# Altium schematic sheet Ampli3.SchDoc
size A4
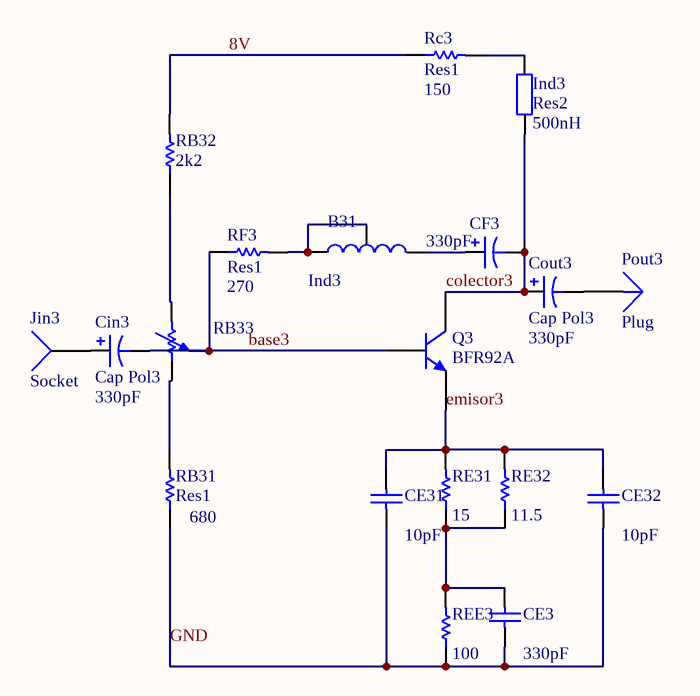
[diagram p0: Ampli3.SchDoc]

## Parts
B31  Ind3  [Ind 7mm]
CE3  value 330pF  [1608[0603]]  (hidden comment: Cap Semi)
CE31  value 10pF  [1608[0603]]  (hidden comment: Cap Semi)
CE32  value 10pF  [1608[0603]]  (hidden comment: Cap Semi)
CF3  value 330pF  [C0805]  (hidden comment: Cap Pol3)
Cin3  Cap Pol3  value 330pF  [C0805]
Cout3  Cap Pol3  value 330pF  [C0805]
Ind3  Res2  value 500nH  [AXIAL-0.4]
Jin3  Socket  [PIN1]
Pout3  Plug  [PIN1]
Q3  BFR92A  [SOT23]
RB31  Res1  value 680  [AXIAL-0.3]
RB32  value 2k2  [AXIAL-0.3]  (hidden comment: Res1)
RB33  Pot  [Potenciometro]  (value not drawn)
Rc3  Res1  value 150  [AXIAL-0.3]
RE31  value 15  [1608[0603]]  (hidden comment: Res Semi)
RE32  value 11.5  [2012[0805]]  (hidden comment: Res Semi)
REE3  value 100  [2012[0805]]  (hidden comment: Res Semi)
RF3  Res1  value 270  [AXIAL-0.3]

## Nets
8V: RB32.2 Rc3.1
base3: Cin3.2 Q3.1(B) RB33.3 RF3.1
colector3: CF3.2 Cout3.1 Ind3.1 Q3.3(C)
emisor3: CE31.2 CE32.2 Q3.2(E) RE31.2 RE32.2
GND: CE3.1 CE31.1 CE32.1 RB31.1 REE3.1
NetB31_0: B31.0 B31.2 RF3.2
NetB31_1: B31.1 CF3.1
NetCE3_2: CE3.2 RE31.1 RE32.1 REE3.2
NetCin3_1: Cin3.1 Jin3.1
NetCout3_2: Cout3.2 Pout3.1
NetInd3_2: Ind3.2 Rc3.2
NetRB31_2: RB31.2 RB33.2
NetRB32_1: RB32.1 RB33.1

## Library data of the parts
CE3 CE31 CE32 = Cap Semi: Capacitor (Semiconductor SIM Model); Published: 8-Jun-2000; LatestRevisionDate: 17-Jul-2002; LatestRevisionNote: Re-released for DXP Platform.; PackageReference: C1206; Publisher: Altium Limited
CF3 Cin3 Cout3 = Cap Pol3: Polarized Capacitor (Surface Mount); Published: 8-Jun-2000; LatestRevisionDate: 17-Jul-2002; LatestRevisionNote: Re-released for DXP Platform.; PackageReference: C0805; Publisher: Altium Limited
Ind3 = Res2: Resistor; Published: 8-Jun-2000; LatestRevisionDate: 17-Jul-2002; LatestRevisionNote: Re-released for DXP Platform.; PackageReference: AXIAL-0.4; Publisher: Altium Limited
Q3 = BFR92A: NPN 5 GHz Wideband Transistor; Published: 17-Sep-2003; DatasheetDocument: 29-Oct-1997; PackageDocument: May-1999; PackageReference: SOT23; Publisher: Altium Limited; ComponentLink1Description: Manufacturer Link; ComponentLink1URL: http://www.semiconductors.philips.com/; ComponentLink2Description: Datasheet; ComponentLink2URL: http://www.semiconductors.philips.com/acrobat/datasheets/BFR92A_2.pdf
RB31 RB32 Rc3 RF3 = Res1: Resistor; Published: 8-Jun-2000; LatestRevisionDate: 17-Jul-2002; LatestRevisionNote: Re-released for DXP Platform.; PackageReference: AXIAL-0.3; Publisher: Altium Limited
RE31 RE32 REE3 = Res Semi: Semiconductor Resistor; Published: 8-Jun-2000; LatestRevisionDate: 17-Jul-2002; LatestRevisionNote: Re-released for DXP Platform.; PackageReference: AXIAL-0.5; Publisher: Altium Limited
Jin3 = Socket: LatestRevisionDate: 17-Jul-2002; LatestRevisionNote: Re-released for DXP Platform.; Publisher: Altium Limited
Pout3 = Plug: LatestRevisionDate: 17-Jul-2002; LatestRevisionNote: Re-released for DXP Platform.; Publisher: Altium Limited